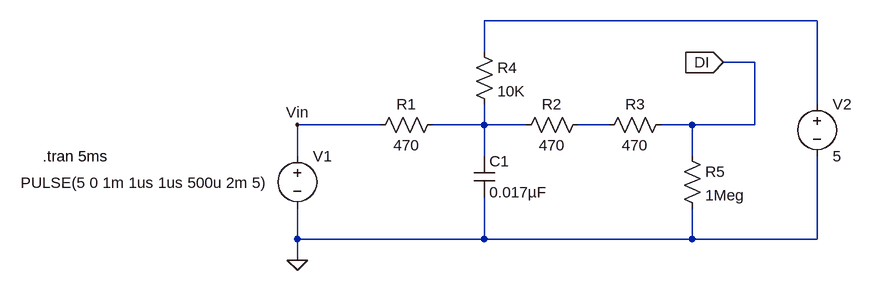
[diagram p0: schematic line-driver.asc]
line-driver.asc, the LTspice schematic file:
Version 4
SHEET 1 1068 680
WIRE 1008 16 496 16
WIRE 496 64 496 16
WIRE 912 80 864 80
WIRE 1008 144 1008 16
WIRE 336 176 208 176
WIRE 496 176 496 144
WIRE 496 176 416 176
WIRE 560 176 496 176
WIRE 688 176 640 176
WIRE 816 176 768 176
WIRE 912 176 912 80
WIRE 912 176 816 176
WIRE 208 224 208 176
WIRE 496 224 496 176
WIRE 816 224 816 176
WIRE 208 352 208 304
WIRE 496 352 496 288
WIRE 496 352 208 352
WIRE 816 352 816 304
WIRE 816 352 496 352
WIRE 1008 352 1008 224
WIRE 1008 352 816 352
WIRE 208 384 208 352
FLAG 208 384 0
FLAG 208 176 Vin
FLAG 864 80 DI
IOPIN 864 80 In
SYMBOL voltage 208 208 R0
WINDOW 3 -44 57 Right 2
SYMATTR Value PULSE(5 0 1m 1us 1us 500u 2m 5)
SYMATTR InstName V1
SYMBOL res 320 192 R270
WINDOW 0 32 56 VTop 2
WINDOW 3 0 56 VBottom 2
SYMATTR InstName R1
SYMATTR Value 470
SYMBOL cap 480 224 R0
SYMATTR InstName C1
SYMATTR Value 0.017µF
SYMBOL res 656 160 R90
WINDOW 0 0 56 VBottom 2
WINDOW 3 32 56 VTop 2
SYMATTR InstName R2
SYMATTR Value 470
SYMBOL res 672 192 R270
WINDOW 0 32 56 VTop 2
WINDOW 3 0 56 VBottom 2
SYMATTR InstName R3
SYMATTR Value 470
SYMBOL res 480 48 R0
SYMATTR InstName R4
SYMATTR Value 10K
SYMBOL res 800 208 R0
SYMATTR InstName R5
SYMATTR Value 1Meg
SYMBOL voltage 1008 128 R0
SYMATTR InstName V2
SYMATTR Value 5
TEXT -184 224 Left 2 !.tran 5ms

The netlist it stands for:
* line-driver.asc
V1 Vin 0 PULSE(5 0 1m 1us 1us 500u 2m 5)
R1 Vin N002 470
C1 N002 0 0.017µF
R2 N003 N002 470
R3 N003 DI 470
R4 N001 N002 10K
R5 DI 0 1Meg
V2 N001 0 5
.tran 5ms
.backanno
.end